# EasyEDA Pro project 数控电源_V3.eprj, board 电源板pcb
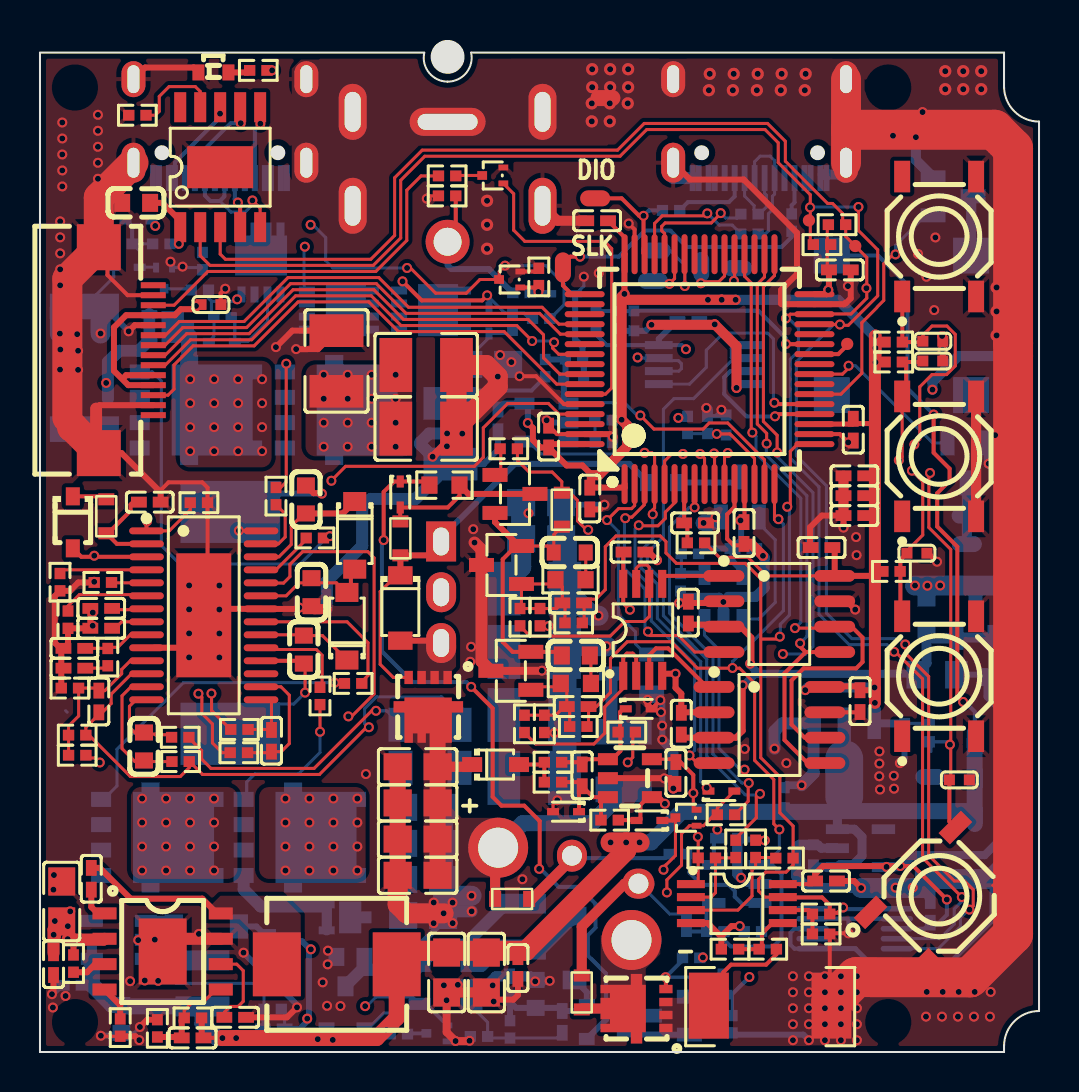
[diagram p9: board, top side]
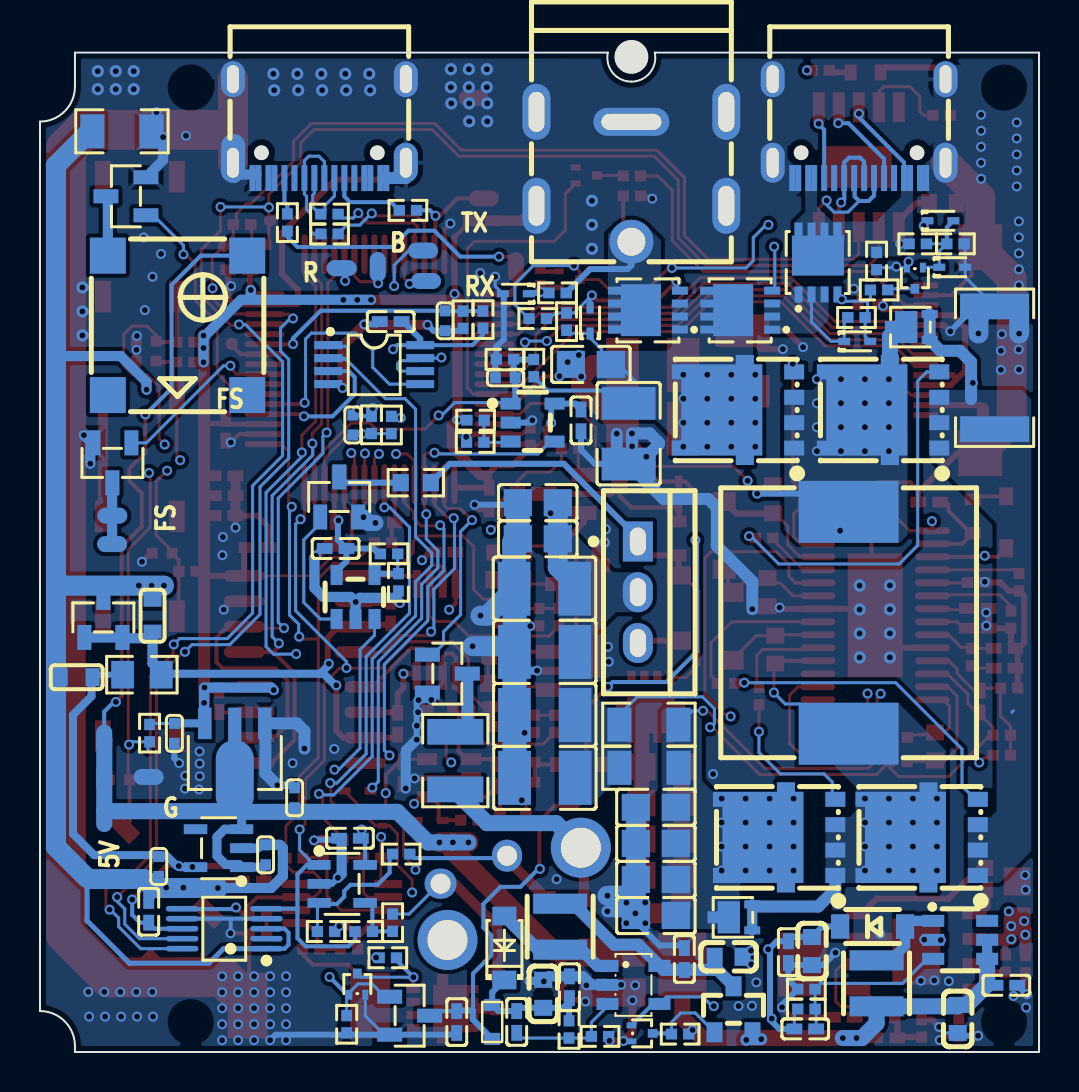
[diagram p10: board, bottom side, seen from below]

Outline 50 x 50.63 mm; copper layers: Top Layer, Inner1, Inner2, Bottom Layer. Coordinates in mm from the lower left corner of the outline.
Outline path: 0,50 19.23,50 arc(19.47,48.99) 20.41,48.55 arc(21.34,48.99) 21.58,50 48.25,50 48.25,48.3 arc(48.76,47.06) 50,46.55 50,2.05 arc(48.76,1.54) 48.25,0.3 48.25,0 0,0 0,50
Stack: Top Layer 0.035mm 外层铜厚1oz / Dielectric1 0.2104mm 7628 RC49% 8.6mil / Inner1 0.0152mm 内层铜厚 / Dielectric2 1.065mm 1.1mm H/HOZ Copper / Inner2 0.0152mm 内层铜厚 / Dielectric3 0.2104mm 7628 RC49% 8.6mil / Bottom Layer 0.035mm 外层铜厚1oz

## Design rules (mm)
net USBDP: USB
net UDBDM: USB
spacing copperThickness1oz (default): track to track 0.152, other pairs 0.152 to 0.3
spacing Plane_innerPlane: track to track 0.152, other pairs 0.152 to 0.3
spacing Copper_copperRegion: track to track 0.152, other pairs 0.152 to 0.3
spacing Copper_DING_GND: track to track 0.152, other pairs 0.152 to 0.3
track width copperThickness1oz (default): min 0.127, default 0.254, max 10
track width copperThickness2oz: min 0.203, default 0.254, max 2.54
differential pair differentialPair (default): width min 0.127, default 0.152, max 2.54; gap min 0.203, default 0.203
net DGND uses DING_GND
pour e2830 uses copperRegion
pour e3047 uses copperRegion
pour e3212 uses DING_GND
pour e3215 uses DING_GND

## Placement (name value [footprint] x y rotation side)
BUZZER1  2.7kHz  [BUZ-SMD_4P-L8.5-W8.5_FUET-8530-05]  43.11 36.36 90 bottom
C1  100nF  [C0402]  2.57 8.67 90 top
C2  10uF  [电容0402]  38.71 9.87 90 bottom
C3  10uF  [电容0402]  44.06 9.29 270 bottom
C4  100nF  [C0402]  0.68 4.4 270 top
C5  22uF  [C0805]  22.34 3.98 90 top
C6  22uF  [C0805]  20.35 3.98 90 top
C7  100nF  [C0402]  23.92 4.2 90 top
C8  10nF  [C0402]  9.77 1.74 180 top
C9  10pF  [C0402]  7.64 0.71 0 top
C11  10uF  [C0402]  40.76 26.84 0 top
C12  10uF  [C0402]  40.76 27.83 0 top
C13  10uF  [C0402]  25.46 30.79 270 top
C14  10uF  [电容0603]  48.16 18.75 180 bottom
C15  10uF  [电容0603]  44.37 21.83 270 bottom
C16  1uF  [C0603]  4.81 42.48 0 top
C17  10uF  [电容0402]  37.25 12.72 90 bottom
C18  10uF  [电容0402]  43.27 15.94 270 bottom
C19  100nF  [C0402]  40.03 39.13 0 top
C20  100nF  [C0402]  27.88 41.59 180 top
C21  100nF  [C0402]  27.52 27.69 270 top
C22  100nF  [C0402]  40.7 31.14 270 top
C23  100nF  [C0402]  32.78 26.47 0 top
C24  100nF  [电容0402]  46.01 13.62 180 top
C25  100nF  [电容0402]  43.89 24.96 180 top
C26  100nF  [C0402]  35.24 25.97 270 top
C27  100nF  [电容0402]  44.68 34.57 180 top
C28  100nF  [电容0402]  44.68 35.56 180 top
C29  100nF  [电容0402]  8.56 37.39 0 top
C30  100nF  [C0402]  39.11 25.24 180 top
C31  100nF  [C0402]  32.1 16.43 90 top
C32  100nF  [C0402]  41.04 17.56 270 top
C33  1uF  [C0603]  5.21 15.29 270 top
C34  100uF  [C1210]  24.75 23.18 180 bottom
C35  100uF  [C1210]  24.74 16.86 180 bottom
C36  100uF  [C1210]  24.74 20.02 180 bottom
C37  100uF  [C1210]  24.73 13.72 180 bottom
C38  100nF  [C0805]  25.08 25.68 180 bottom
C39  100nF  [C0805]  25.09 27.48 180 bottom
C40  10pF  [C0402]  2.95 17.54 270 top
C41  100nF  [C0402]  5.5 27.51 0 top
C42  1uF  [C0603]  13.31 27.64 270 top
C43  1uF  [C0603]  13.2 20.13 90 top
C44  220pF  [C0402]  3.07 22.19 0 top
C49  560pF  [C0402]  1.72 20.2 0 top
C50  100nF  [C0402]  3.07 21.2 0 top
C51  33nF  [C0402]  1.72 19.2 0 top
C52  100uF  [C1210]  14.84 34.57 270 top
C53  100uF  [C1210]  20.54 30.93 90 bottom
C54  100uF  [C1210]  19.33 34.37 180 top
C55  100uF  [C1210]  19.33 31.19 180 top
C56  100nF  [C0805]  22.43 34.4 180 bottom
C58  1uF  [C0603]  13.59 23.01 90 top
C59  47pF  [C0402]  11.59 15.57 270 top
C60  68nF  [C0603]  26.82 19.84 180 top
C61  10pF  [C0402]  26.91 17.28 0 top
C62  68nF  [C0603#2]  26.51 24.99 0 top
C63  10pF  [C0402]  26.69 22.47 180 top
C64  10uF  [C0805]  18.9 12.46 0 top
C65  10uF  [C0805]  18.9 14.27 0 top
C66  100nF  [C0805]  18.9 10.65 0 top
C67  100nF  [C0805]  18.9 8.84 0 top
C68  100nF  [C0402]  32.45 36.54 0 bottom
C69  100nF  [C0402]  35.2 25.19 0 bottom
C70  100nF  [C0402]  34.49 10.69 0 bottom
C71  100nF  [C0402]  27.14 13.84 270 top
C72  10pF  [C0402]  26.14 1.51 90 bottom
C73  100nF  [C0402]  32.45 21.98 90 top
C74  100nF  [C0402]  29.75 25.01 0 top
C76  100nF  [C0402]  17.75 4.65 270 bottom
C78  100nF  [C0402]  23.5 3.24 270 bottom
C79  100nF  [C0402]  31.83 13.96 270 top
C80  100nF  [C0402]  44.56 7.02 90 bottom
C81  10pF  [C0402]  11.7 1.16 0 bottom
C82  10uF  [C0603]  11.36 5.05 90 bottom
C83  100nF  [C0402]  12.54 5 90 bottom
C84  100nF  [C0402]  39.34 8.56 0 top
C85  100nF  [电容0402]  26.71 33.73 180 bottom
C86  100nF  [电容0402]  34.34 31.37 270 bottom
C87  100nF  [C0402]  22.92 31.6 270 bottom
C88  100nF  [电容0402]  29.73 36.58 90 bottom
C91  1uF  [C0603]  15.54 4.76 0 bottom
C92  1uF  [C0603]  24.81 2.91 270 bottom
C93  100nF  [C0402]  29.14 1.5 90 bottom
C98  100nF  [C0402]  1.63 3.34 0 bottom
C99  10uF  [C0805]  19.18 6.83 180 bottom
C100  10uF  [C0805]  19.18 8.63 180 bottom
C101  10uF  [C0805]  19.18 10.44 180 bottom
C102  10uF  [C0805]  19.18 12.24 180 bottom
C103  10uF  [C0805]  1.09 7.53 270 top
C105  10uF  [C0603]  4.07 1.65 90 bottom
C106  10uF  [C0402]  40.76 28.83 0 top
D1  TPZ13VC-523  [SOD-523_L1.2-W0.8-LS1.6-RD]  9.1 35.56 180 bottom
D2  1N5819WS S4  [SOD-323_L1.6-W1.3-LS2.7-RD]  1.64 26.5 270 top
D3  DSS110  [SOD-123_L2.8-W1.8-LS3.7-RD]  15.75 25.85 270 top
D4  DSS110  [SOD-123_L2.8-W1.8-LS3.7-RD]  15.36 21.3 90 top
D6  BZT52C12  [SOD-123_L2.7-W1.6-LS3.7-RD]  18.03 22.21 270 top
D7  MM5Z3V3  [SOD-523_L1.2-W0.8-LS1.6-RD]  29.96 17.17 0 top
D8  TPSDM20U40  [SOD-523_L1.2-W0.8-LS1.6-RD]  34.1 13.06 0 top
D9  TPZ13VC-523  [SOD-523_L1.2-W0.8-LS1.6-RD]  22.47 36.6 90 bottom
D11  MM5Z3V3  [SOD-523_L1.2-W0.8-LS1.6-RD]  26.33 12.02 180 top
D12  1N5819W  [SOD-123_L2.7-W1.6-LS3.7-R-RD]  8.33 6.28 180 bottom
D13  1N5819WS  [SOD-323_L1.8-W1.3-LS2.5-RD]  22.8 14.38 0 top
D15  TPZ13VC-523  [SOD-523_L1.2-W0.8-LS1.6-RD]  26.18 37.94 0 bottom
D20  PMEG6020EPA,115  [SOT-1061_L2.0-W2.0-P1.30-BR]  6.23 36.27 180 bottom
D21  PMEG6020EPA,115  [SOT-1061_L2.0-W2.0-P1.30-BR]  15.11 6.74 180 bottom
D23  TPZ13VC-523  [SOD-523_L1.2-W0.8-LS1.6-RD]  4.34 39.26 180 bottom
D24  TPSDM20U40  [SOD-523_L1.2-W0.8-LS1.6-RD]  30.5 11.58 180 top
D25  TPSDM20U40  [SOD-523_L1.2-W0.8-LS1.6-RD]  18.03 27.89 270 top
H1  -  [DC-2-DIP]  22.93 10.22 270 top
H2  1mm通孔  [DC-1-DIP]  26.62 9.83 180 top
H3  -  [DC-2-DIP]  29.6 5.61 180 bottom
H4  1mm通孔  [DC-1-DIP]  29.95 8.42 270 top
L1  4.7uH  [IND-SMD_L7.0-W6.6]  14.85 4.39 0 top
L2  2.2uH  [IND-SMD_L13.5-W12.8_TMPC1265HP]  9.53 21.47 270 bottom
L3  4.7uH  [IND-SMD_L3.0-W3.0-1]  23.97 6.27 270 bottom
L4  4.7uH  [IND-SMD_L3.0-W3.0-1]  8.13 3.44 90 bottom
LED1  侧帖 绿  [LED-SMD_L1.7-W1.1-R-RD_GREEN]  8.68 49.01 0 top
NOREF  -  [Pad_e446]  38.49 41.6 0 top
NOREF#2  -  [Pad_e448]  40.4 35.43 0 top
NOREF#3  -  [Pad_e447]  40.8 40.32 0 top
Q1  DOZ40P04  [PDFN-8_L3.1-W3.1-P0.65-LS3.4-BL]  14.96 37.12 90 bottom
Q2  DOZ40P04  [PDFN-8_L3.1-W3.1-P0.65-LS3.4-BL]  11.06 39.5 180 bottom
Q3  DOZ40P04  [PDFN-8_L3.1-W3.1-P0.65-LS3.4-BL]  19.57 37.12 90 bottom
Q4  40N06D  [WDFN-5_L3.3-W3.3-P0.65-BL]  19.43 18 180 top
Q5  2N7002  [SOT-23-3_L2.9-W1.3-P1.90-LS2.4-BR]  35.02 27.77 270 bottom
Q6  BSS138NH6327-ES  [SOT-23-3_L2.9-W1.3-P1.90-LS2.4-BR]  23.77 27.92 180 top
Q7  AP2310  [SOT-23-3_L2.9-W1.3-P1.90-LS2.4-BR]  29.61 18.93 0 bottom
Q8  40N06D  [WDFN-5_L3.3-W3.3-P0.65-BL]  30.59 2.18 90 top
Q10  2N7002  [SOT-23-3_L2.9-W1.3-P1.90-LS2.4-BR]  31.5 1.82 0 bottom
Q13  AO3400A  [SOT-23-3_L2.9-W1.3-P1.90-LS2.4-BR]  46.37 29.47 90 bottom
Q14  2N7002KM  [SOT-723-3_L1.2-W0.8-P0.80-LS1.2-BR]  6.21 38.71 90 bottom
Q15  2N7002KM  [SOT-723-3_L1.2-W0.8-P0.80-LS1.2-BR]  23.51 38.65 0 top
Q16  2N7002-HXY  [SOT-23-3_L2.9-W1.3-P1.90-LS2.4-BR]  45.7 42.81 180 bottom
Q17  2N7002KM  [SOT-723-3_L1.2-W0.8-P0.80-LS1.2-BR]  22.66 43.85 0 top
Q18  AO3401A  [SOT-23_L2.9-W1.3-P1.90-LS2.4-BR]  15.29 2.14 270 bottom
Q19  2N7002KM  [SOT-723-3_L1.2-W0.8-P0.80-LS1.2-BR]  19.87 0.93 0 bottom
Q20  KM3139K  [SOT-723-3_L1.2-W0.8-P0.80-LS1.2-BR]  32.33 11.72 0 top
Q21  2N7002KM  [SOT-723-3_L1.2-W0.8-P0.80-LS1.2-BR]  34.12 3.4 270 bottom
R1  20kΩ  [R0402]  8.13 39.57 90 bottom
R2  180kΩ  [R0402]  1.68 4.42 90 top
R3  30kΩ  [R0402]  9.14 36.75 0 bottom
R4  10kΩ  [R0402]  6.07 40.43 0 bottom
R5  30kΩ  [R0402]  20.38 42.83 0 top
R6  100kΩ  [R0402]  7.65 1.71 0 top
R7  200kΩ  [R0402]  4.02 1.22 90 top
R8  30kΩ  [R0402]  23.65 36.54 270 bottom
R9  20kΩ  [R0402]  5.88 1.18 270 top
R10  10kΩ  [R0402]  8 38.13 180 bottom
R11  10kΩ  [R0402]  25.09 36.69 180 bottom
R12  10kΩ  [R0402]  24.1 37.98 180 bottom
R13  30Ω  [R0805_NEW]  44.9 18.88 180 bottom
R15  30kΩ  [R0402]  4.18 40.43 0 bottom
R16  30kΩ  [R0402]  24.96 38.78 270 top
R18  210kΩ  [R0402]  4.88 46.87 180 top
R19  0Ω  [R1206]  45.9 46.06 0 bottom
R20  680Ω  [R0402]  10.93 49.11 180 top
R21  10kΩ  [R0402]  32.83 25.47 180 top
R22  10kΩ  [R0402]  44.52 15.95 270 bottom
R23  100Ω  [R0402]  7.04 14.53 0 top
R24  100Ω  [R0402]  7.02 15.75 0 top
R25  10kΩ  [R0402]  7.95 27.48 0 top
R26  10Ω  [R0603#2]  3.32 26.8 90 top
R27  200kΩ  [R0402]  1 23.51 90 top
R28  0Ω  [R0402]  14.01 17.81 90 top
R29  300kΩ  [R0402]  1.86 15.85 0 top
R30  0Ω  [R0402]  11.81 27.81 90 top
R31  0Ω  [R0402]  3.15 23.49 0 top
R32  20kΩ  [R0402]  1.4 21.63 90 top
R33  30kΩ  [R0402]  1.86 14.85 0 top
R34  10kΩ  [R0402]  1.5 18.21 0 top
R35  10kΩ  [R0402]  3.39 19.76 90 top
R36  0Ω  [R0402]  13.76 25.72 0 top
R37  0Ω  [R0402]  15.67 18.44 0 top
R38  100Ω  [R0402]  9.95 14.97 180 top
R39  3mΩ  [R2512]  2.22 34.23 270 bottom
R40  100Ω  [R0402]  9.98 16.14 180 top
R41  470Ω  [R0603]  26.82 18.44 0 top
R42  1kΩ  [R0402]  32.53 24.92 180 bottom
R43  10kΩ  [R0402]  42.62 24.05 0 top
R44  1kΩ  [R0402]  32.06 23.5 90 bottom
R45  150Ω  [R0603]  26.55 23.63 180 top
R46  10kΩ  [R0603]  20.24 28.36 180 top
R47  330Ω  [R0603#2]  26.12 27.13 90 top
R48  15kΩ  [R0402]  26.94 16.28 0 top
R49  10kΩ  [R0402]  42.73 34.52 0 top
R50  2kΩ  [R0603#2]  18.04 25.7 270 top
R51  100kΩ  [R0402]  33.37 9.71 0 top
R52  750Ω  [R1210]  29.21 14.58 270 bottom
R53  12kΩ  [R0402]  24.25 16.42 270 top
R54  12kΩ  [R0402]  24.02 21.75 270 top
R55  4.3kΩ  [R0402]  23.46 30.18 0 top
R56  68kΩ  [R0402]  25.24 16.42 270 top
R57  68kΩ  [R0402]  25.02 21.75 270 top
R58  10kΩ  [R0402]  34.82 10.16 90 top
R59  10kΩ  [R0402]  37.26 9.7 180 top
R60  100kΩ  [R0402]  35.81 10.16 90 top
R61  10kΩ  [R0402]  42.73 35.52 0 top
R62  510Ω  [R0603#2]  27.37 1.51 90 bottom
R63  10kΩ  [R0402]  32.59 4.71 0 bottom
R64  47kΩ  [R0402]  29.37 16.01 0 top
R65  2kΩ  [R0402]  39.89 41.39 180 top
R66  2kΩ  [R0402]  39.14 40.39 0 top
R67  0Ω  [R0402]  37.62 41.5 90 bottom
R68  20kΩ  [R0402]  25.68 14.5 180 top
R69  0Ω  [R0402]  31.59 42.11 180 bottom
R70  2kΩ  [R0402]  34.33 11.87 180 top
R71  2kΩ  [R0402]  25.68 13.5 180 top
R72  20kΩ  [R0402]  17.96 0.9 0 bottom
R73  51kΩ  [R0402]  23.52 1.13 90 bottom
R75  56kΩ  [R0402]  28.51 11.6 180 top
R76  1.8kΩ  [R0402]  21.97 0.78 0 bottom
R77  40mΩ  [RES-SMD_L6.4-W3.2-R2512]  36.55 2.32 180 top
R78  10kΩ  [R0402]  34.65 1.39 270 bottom
R79  10kΩ  [R0402]  32.35 6.47 270 bottom
R80  1kΩ  [R0402]  33.8 6.03 0 bottom
R81  1.2kΩ  [R0402]  39.09 5.91 180 top
R82  15kΩ  [R0402]  39.09 6.91 0 top
R84  13kΩ  [R0402]  11.64 2.15 0 bottom
R85  12kΩ  [R0402]  25.29 34.21 270 bottom
R86  12kΩ  [R0402]  32.41 31.37 90 bottom
R87  1.2kΩ  [R0402]  36.42 5.15 180 top
R88  100Ω  [R0603#2]  23.63 7.66 0 top
R89  1kΩ  [R0402]  11.64 3.15 180 bottom
R90  15kΩ  [R0402]  34.53 5.15 180 top
R92  1kΩ  [R0402]  26.73 34.66 180 bottom
R93  1kΩ  [R0402]  33.41 31.38 270 bottom
R94  10kΩ  [R0402]  31.92 9.9 0 bottom
R95  1kΩ  [R0402]  35.68 6.03 180 bottom
R96  100Ω  [R0603#2]  27.11 2.98 90 top
R97  NCP15XH103F03RC  [R0402]  27.83 36.64 270 bottom
R98  20kΩ  [R0402]  28.2 31.61 0 bottom
R99  1kΩ  [R0402]  28.83 36.63 90 bottom
R100  2.4kΩ  [R0402]  28.22 30.5 180 bottom
R101  15kΩ  [R0402]  26.71 21.47 180 top
R102  22Ω  [R0402]  35.51 41.92 180 bottom
R103  22Ω  [R0402]  35.51 40.93 180 bottom
R104  510Ω  [R0603]  31.19 28.48 180 bottom
R105  10Ω  [R0402]  20.38 43.83 180 top
SW1  BTS0C0052MMG00  [SW-SMD_4P-L5.2-W5.2-P3.70-LS6.4]  45 7.8 45 top
SW2  BTS0C0052MMG00  [SW-SMD_4P-L5.2-W5.2-P3.70-LS6.4]  45 18.8 90 top
SW3  BTS0C0052MMG00  [SW-SMD_4P-L5.2-W5.2-P3.70-LS6.4]  45 29.8 90 top
SW4  BTS0C0052MMG00  [SW-SMD_4P-L5.2-W5.2-P3.70-LS6.4]  45 40.8 90 top
U1  H7211-33M5R  [SOT-23-5_L3.0-W1.7-P0.95-LS2.8-BL]  41.06 10.2 90 bottom
U2  SCT2432STER  [ESOP-8_L4.9-W3.9-P1.27-LS6.0-BL-EP]  6.14 5.03 270 top
U3  DC007B-2.5-J  [DC-IN-TH_HX-DC007B-2.5]  20.4 43.79 270 bottom
U4  TPSDM20U40  [SOD-523_L1.2-W0.8-LS1.6-RD]  4.94 41.59 180 bottom
U5  TL431  [SOT-23-3_L2.9-W1.3-P1.90-LS2.4-BR]  46.83 21.74 270 bottom
U7  CH224A  [ESSOP-10_L4.9-W3.9-P1.0-LS6.0-TL-EP]  9.02 44.27 0 top
U8  AT32F403ARCT7  [LQFP-64_L10.0-W10.0-P0.50-LS12.0-BL]  33.01 34.16 0 top
U9  -  [SMT_0.8*1.5]  26.17 39.25 0 top
U10  -  [SMT_0.8*1.5]  27.79 42.71 270 top
U11  AFD01-S14FCA-00  [FPC-SMD_14P-P0.50_JS_AFD01-S14FCA-00]  4.31 35.11 90 top
U12  DAC8830ICDR  [SOIC-8_L4.9-W3.9-P1.27-LS6.0-BL]  37 21.92 270 top
U13  DAC8830ICDR  [SOIC-8_L4.9-W3.9-P1.27-LS6.0-BL]  36.51 16.36 270 top
U14  RS8552XM  [MSOP-8_L3.0-W3.0-P0.65-LS4.9-BL]  30.17 21.12 0 top
U16  12mΩ  [R1206]  19.52 16.38 0 bottom
U17  LM5176PWPR  [HTSSOP-28_L9.8-W4.5-P0.65-LS6.6-BL-EP]  8.2 21.85 270 top
U18  12mΩ  [R1206]  19.52 14.22 0 bottom
U19  80N06F  [DFN-5_L4.9-W5.9-P1.27-LS6.2-BL]  14.07 32.12 90 bottom
U20  80N06F  [DFN-5_L4.9-W5.9-P1.27-LS6.2-BL]  12.01 10.74 90 bottom
U21  80N06F  [DFN-5_L4.9-W5.9-P1.27-LS6.2-BL]  6.81 32.12 90 bottom
U22  80N06F  [DFN-5_L4.9-W5.9-P1.27-LS6.2-BL]  4.87 10.74 90 bottom
U23  GS8743-TR  [SOT-23-5_L2.9-W1.6-P0.95-LS2.8-BL]  34.21 22.76 180 bottom
U24  MPG90N08P  [TO-220-3_L10.2-W4.6-P2.54-L]  20.08 23 270 bottom
U25  BL432 1%  [SOT-23-3_L2.9-W1.3-P0.95-LS2.4-BR]  23.57 19.07 0 top
U26  BL432 1%  [SOT-23-3_L2.9-W1.3-P0.95-LS2.4-BR]  23.1 24.37 0 top
U27  RS8551XF  [SOT-23-5_L3.0-W1.7-P0.95-LS2.8-BL]  34.88 8.41 270 bottom
U29  K26  [SOD-123FL_L2.8-W1.8-LS3.8-RD]  26.76 5.2 90 bottom
U30  ADS1115IDGSR  [MSOP-10_L3.0-W3.0-P0.50-LS5.0-BL]  40.78 6.17 90 bottom
U31  RS321BXF  [SOT-23-5_L2.9-W1.6-P0.95-LS2.8-BL]  29.52 13.7 270 top
U32  SGM6601YTN5G/TR  [SOT-23-5_L3.0-W1.7-P0.95-LS2.8-BR]  20.3 3.36 0 bottom
U33  LN3608AR-G  [SOT-23-6_L2.9-W1.6-P0.95-LS2.8-BR]  3.95 5.61 0 bottom
U34  -  [SMT_0.8*1.5]  46.79 11.76 180 bottom
U35  -  [SMT_0.8*1.5]  46.79 15.63 0 bottom
U36  -  [SMT_0.8*1.5]  46.38 26.84 90 bottom
U37  -  [SMT_0.8*1.5]  30.83 40.1 270 bottom
U38  -  [SMT_0.8*1.5]  46.39 25.41 270 bottom
U39  GSV331-TR  [SOT-23-5_L2.9-W1.6-P0.95-LS2.8-BR]  25.35 31.49 0 bottom
U40  -  [SMT_0.8*1.5]  30.68 38.57 90 bottom
U41  -  [SMT_0.8*1.5]  46.79 13.69 0 bottom
U42  -  [SMT_0.8*1.5]  34.9 39.21 270 bottom
U43  -  [SMT_0.8*1.5]  28.3 47.73 90 top
U44  -  [SMT_0.8*1.5]  33.1 39.27 180 bottom
U45  -  [SMT_0.8*1.5]  44.56 13.76 270 bottom
U47  RS8552XM  [MSOP-8_L3.0-W3.0-P0.65-LS4.9-BL]  33.27 34.39 270 bottom
U48  RS8552XM  [MSOP-8_L3.0-W3.0-P0.65-LS4.9-BL]  34.88 7.43 270 top
U49  MG6228N3B-33  [SOT-89-3_L4.5-W2.5-P1.50-LS4.2-BR]  40.25 15.09 90 bottom
USBC1  TYPE-C-31-M-12  [USB-C_SMD-TYPE-C-31-M-12]  9.01 46.2 0 bottom
USBC2  TYPE-C-31-M-12  [USB-C_SMD-TYPE-C-31-M-12]  36.02 46.2 0 bottom

## Footprints (pads in the part's own frame, mm; a bottom-side part is the same pattern mirrored in y, then rotated)
BUZ-SMD_4P-L8.5-W8.5_FUET-8530-05
  rect 1.8x1.8 smd: 1(3.488,-3.488) 2(3.488,3.488) 3(-3.488,3.488) 4(-3.488,-3.488)
C0402
  rect 0.79x0.54 smd: 1(-0.545,0) 2(0.545,0)
C0603
  rect 0.8x0.9 smd: 1(-0.7,0) 2(0.7,0)
C0603#2
  rect 0.7x0.8 smd: 1(-0.8,0) 2(0.8,0)
C0805
  rect 1.41x1.35 smd: 1(-1,0) 2(1,0)
C1210
  rect 1.635x2.7 smd: 1(-1.518,0) 2(1.518,0)
DC-1-DIP
  oval 1.5x1.6 hole 1: 1(-0.004,0.004)
DC-2-DIP
  round 3 hole 2: 1(0,0)
DC-IN-TH_HX-DC007B-2.5
  round 2.2 hole 1.4: 1(3.25,0)
  oval 1.4x3.8 hole 0.8x3: 2(-2.75,0)
  oval 2.8x1.4 hole 2x0.8: 3(-3.25,-4.75) 3(-3.25,4.75) 3(1.45,-4.75) 3(1.45,4.75)
DFN-5_L4.9-W5.9-P1.27-LS6.2-BL
  rect 0.75x1 smd: 1(-1.905,-1.811) 2(-0.635,-1.811) 3(0.635,-1.811) 4(1.905,-1.811)
  custom 5.51x4.53 smd: 5(0,1.811)
ESOP-8_L4.9-W3.9-P1.27-LS6.0-BL-EP
  rect 0.6x1.2 smd: 1(-1.905,-2.909) 2(-0.635,-2.909) 3(0.635,-2.909) 4(1.905,-2.909) 5(1.905,2.909) 6(0.635,2.909) 7(-0.635,2.909) 8(-1.905,2.909)
  rect 3.3x2.4 smd: 9(0,0)
ESSOP-10_L4.9-W3.9-P1.0-LS6.0-TL-EP
  rect 0.6x1.5 smd: 1(-2,-3) 2(-1,-3) 3(0,-3) 4(1,-3) 5(2,-3) 6(2,3) 7(1,3) 8(0,3) 9(-1,3) 10(-2,3)
  rect 3.3x2.1 smd: 11(0,0)
FPC-SMD_14P-P0.50_JS_AFD01-S14FCA-00
  rect 0.3x1.25 smd: 1(-3.25,-1.363) 2(-2.75,-1.363) 3(-2.25,-1.363) 4(-1.75,-1.363) 5(-1.25,-1.363) 6(-0.75,-1.363) 7(-0.25,-1.363) 8(0.25,-1.363) 9(0.75,-1.363) 10(1.25,-1.363) 11(1.75,-1.363) 12(2.25,-1.363) 13(2.75,-1.363) 14(3.25,-1.363)
  rect 2.3x2.2 smd: 15(5.15,1.363) 16(-5.15,1.363)
HTSSOP-28_L9.8-W4.5-P0.65-LS6.6-BL-EP
  oval 0.343x1.732 smd: 1(-4.225,-2.866) 2(-3.575,-2.866) 3(-2.925,-2.866) 4(-2.275,-2.866) 5(-1.625,-2.866) 6(-0.975,-2.866) 7(-0.325,-2.866) 8(0.325,-2.866) 9(0.975,-2.866) 10(1.625,-2.866) 11(2.275,-2.866) 12(2.925,-2.866) 13(3.575,-2.866) 14(4.225,-2.866) 15(4.225,2.866) 16(3.575,2.866) 17(2.925,2.866) 18(2.275,2.866) 19(1.625,2.866) 20(0.975,2.866) 21(0.325,2.866) 22(-0.325,2.866) 23(-0.975,2.866) 24(-1.625,2.866) 25(-2.275,2.866) 26(-2.925,2.866) 27(-3.575,2.866) 28(-4.225,2.866)
  rect 6.2x2.75 smd: 29(0,0)
IND-SMD_L3.0-W3.0-1
  rect 1x2.7 smd: 1(-1.15,0) 2(1.15,0)
IND-SMD_L7.0-W6.6
  rect 2.4x3.2 smd: 1(-3,0) 2(3,0)
IND-SMD_L13.5-W12.8_TMPC1265HP
  rect 3.1x5 smd: 1(-5.55,0) 2(5.55,0)
LED-SMD_L1.7-W1.1-R-RD_GREEN
  rect 0.6x0.8 smd: 1(0.75,0) 2(-0.75,0)
LQFP-64_L10.0-W10.0-P0.50-LS12.0-BL
  oval 0.3x2 smd: 1(-3.75,-5.75) 2(-3.25,-5.75) 3(-2.75,-5.75) 4(-2.25,-5.75) 5(-1.75,-5.75) 6(-1.25,-5.75) 7(-0.75,-5.75) 8(-0.25,-5.75) 9(0.25,-5.75) 10(0.75,-5.75) 11(1.25,-5.75) 12(1.75,-5.75) 13(2.25,-5.75) 14(2.75,-5.75) 15(3.25,-5.75) 16(3.75,-5.75) 33(3.75,5.75) 34(3.25,5.75) 35(2.75,5.75) 36(2.25,5.75) 37(1.75,5.75) 38(1.25,5.75) 39(0.75,5.75) 40(0.25,5.75) 41(-0.25,5.75) 42(-0.75,5.75) 43(-1.25,5.75) 44(-1.75,5.75) 45(-2.25,5.75) 46(-2.75,5.75) 47(-3.25,5.75) 48(-3.75,5.75)
  oval 2x0.3 smd: 17(5.75,-3.75) 18(5.75,-3.25) 19(5.75,-2.75) 20(5.75,-2.25) 21(5.75,-1.75) 22(5.75,-1.25) 23(5.75,-0.75) 24(5.75,-0.25) 25(5.75,0.25) 26(5.75,0.75) 27(5.75,1.25) 28(5.75,1.75) 29(5.75,2.25) 30(5.75,2.75) 31(5.75,3.25) 32(5.75,3.75) 49(-5.75,3.75) 50(-5.75,3.25) 51(-5.75,2.75) 52(-5.75,2.25) 53(-5.75,1.75) 54(-5.75,1.25) 55(-5.75,0.75) 56(-5.75,0.25) 57(-5.75,-0.25) 58(-5.75,-0.75) 59(-5.75,-1.25) 60(-5.75,-1.75) 61(-5.75,-2.25) 62(-5.75,-2.75) 63(-5.75,-3.25) 64(-5.75,-3.75)
MSOP-8_L3.0-W3.0-P0.65-LS4.9-BL
  rect 0.406x1.397 smd: 1(-0.975,-2.3) 2(-0.325,-2.3) 3(0.325,-2.3) 4(0.975,-2.3) 5(0.975,2.3) 6(0.325,2.3) 7(-0.325,2.3) 8(-0.975,2.3)
MSOP-10_L3.0-W3.0-P0.50-LS5.0-BL
  oval 0.28x1.62 smd: 1(-1,-2.11) 2(-0.5,-2.11) 3(0,-2.11) 4(0.5,-2.11) 5(1,-2.11) 6(1,2.11) 7(0.5,2.11) 8(0,2.11) 9(-0.5,2.11) 10(-1,2.11)
Pad_e446
  round 0.61 smd: TP1(0,0)
Pad_e447
  round 0.61 smd: TP2(0,0)
Pad_e448
  round 0.61 smd: TP1(0,0)
PDFN-8_L3.1-W3.1-P0.65-LS3.4-BL
  rect 0.4x0.8 smd: 1(-0.975,-1.6) 2(-0.325,-1.6) 3(0.325,-1.6) 4(0.975,-1.6) 5(0.975,1.6) 6(0.325,1.6) 7(-0.325,1.6) 8(-0.975,1.6)
  rect 2.6x2 smd: 9(-0.004,0.35)
R0402
  rect 0.566x0.54 smd: 1(-0.433,0) 2(0.433,0)
R0603
  rect 0.806x0.864 smd: 1(-0.753,0) 2(0.753,0)
R0603#2
  rect 0.6x0.8 smd: 1(-0.85,0) 2(0.85,0)
R0805_NEW
  rect 1.133x1.377 smd: 1(-0.966,0) 2(0.966,0)
R1206
  rect 1.208x1.701 smd: 1(-1.479,0) 2(1.479,0)
R1210
  rect 1.282x2.808 smd: 1(-1.441,0) 2(1.441,0)
R2512
  rect 1.282x3.456 smd: 1(-3.067,0) 2(3.067,0)
RES-SMD_L6.4-W3.2-R2512
  rect 2x3.3 smd: 1(-3.067,0) 2(3.067,0)
SMT_0.8*1.5
  oval 0.8x1.5 smd: 1(0,0)
SOD-123_L2.7-W1.6-LS3.7-R-RD
  rect 0.909x1.219 smd: 1(1.625,0) 2(-1.625,0)
SOD-123_L2.7-W1.6-LS3.7-RD
  rect 0.91x1.22 smd: 1(-1.635,0) 2(1.635,0)
SOD-123_L2.8-W1.8-LS3.7-RD
  rect 0.95x1.15 smd: 1(-1.692,0) 2(1.692,0)
SOD-123FL_L2.8-W1.8-LS3.8-RD
  rect 0.93x1.2 smd: 1(-1.6,0) 2(1.6,0)
SOD-323_L1.6-W1.3-LS2.7-RD
  rect 0.9x0.7 smd: 1(-1.3,0) 2(1.3,0)
SOD-323_L1.8-W1.3-LS2.5-RD
  rect 1x0.75 smd: 1(-1.173,0) 2(1.173,0)
SOD-523_L1.2-W0.8-LS1.6-RD
  rect 0.6x0.36 smd: 1(-0.65,0) 2(0.65,0)
SOIC-8_L4.9-W3.9-P1.27-LS6.0-BL
  oval 0.588x2.045 smd: 1(-1.905,-2.772) 2(-0.635,-2.772) 3(0.635,-2.772) 4(1.905,-2.772) 5(1.905,2.772) 6(0.635,2.772) 7(-0.635,2.772) 8(-1.905,2.772)
SOT-23-3_L2.9-W1.3-P0.95-LS2.4-BR
  rect 1.25x0.7 smd: 1(1,-0.95) 2(1,0.95) 3(-1,0)
SOT-23-3_L2.9-W1.3-P1.90-LS2.4-BR
  rect 1.25x0.7 smd: 1(1,-0.95) 2(1,0.95) 3(-1,0)
SOT-23-5_L2.9-W1.6-P0.95-LS2.8-BL
  rect 0.6x1 smd: 1(-0.95,-1.1) 2(0,-1.1) 3(0.95,-1.1) 4(0.95,1.1) 5(-0.95,1.1)
SOT-23-5_L2.9-W1.6-P0.95-LS2.8-BR
  rect 1x0.6 smd: 1(1.1,-0.95) 2(1.1,0) 3(1.1,0.95) 4(-1.1,0.95) 5(-1.1,-0.95)
SOT-23-5_L3.0-W1.7-P0.95-LS2.8-BL
  rect 0.49x1.157 smd: 1(-0.95,-1.153) 2(0,-1.153) 3(0.95,-1.153)
  rect 0.49x1.175 smd: 4(0.95,1.153) 5(-0.95,1.153)
SOT-23-5_L3.0-W1.7-P0.95-LS2.8-BR
  rect 1.1x0.6 smd: 1(1.3,-0.95) 2(1.3,0) 3(1.3,0.95) 4(-1.3,0.95) 5(-1.3,-0.95)
SOT-23-6_L2.9-W1.6-P0.95-LS2.8-BR
  rect 1.1x0.6 smd: 1(1.35,-0.95) 2(1.35,0) 3(1.35,0.95) 4(-1.35,0.95) 5(-1.35,0) 6(-1.35,-0.95)
SOT-23_L2.9-W1.3-P1.90-LS2.4-BR
  rect 1x0.8 smd: 1(1.15,-0.95) 2(1.15,0.95) 3(-1.15,0)
SOT-89-3_L4.5-W2.5-P1.50-LS4.2-BR
  rect 1.575x0.672 smd: 1(1.356,-1.5) 3(1.356,1.5)
  custom 5.377x1.9 smd: 2(-1.356,0)
SOT-723-3_L1.2-W0.8-P0.80-LS1.2-BR
  rect 0.489x0.294 smd: 1(0.529,-0.4) 2(0.529,0.4)
  rect 0.489x0.434 smd: 3(-0.529,0)
SOT-1061_L2.0-W2.0-P1.30-BR
  rect 0.8x0.399 smd: 1(0.757,-0.65) 2(0.757,0.65)
  custom 1.625x1.6 smd: 3(-0.757,0)
SW-SMD_4P-L5.2-W5.2-P3.70-LS6.4
  rect 1.58x0.8 smd: 1(-3,1.85) 2(3,1.85) 3(-3,-1.85) 4(3,-1.85)
TO-220-3_L10.2-W4.6-P2.54-L
  rect 2x1.5 hole 1.4x0.8: 1(-2.54,0)
  oval 2x1.5 hole 1.4x0.8: 2(0,0) 3(2.54,0)
USB-C_SMD-TYPE-C-31-M-12
  oval 1.2x2 hole 0.6x1.5: 0(-4.325,1.706) 1(4.325,1.706)
  oval 1.2x1.8 hole 0.6x1.4: 2(4.325,-2.474) 3(-4.325,-2.474)
  rect 0.3x1.3 smd: A1(-3.35,2.474) A4(-2.55,2.474) A5(-1.25,2.474) A6(-0.25,2.474) A7(0.25,2.474) A8(1.25,2.474) A9(2.55,2.474) A12(3.35,2.474) B1(3.05,2.474) B4(2.25,2.474) B5(1.75,2.474) B6(0.75,2.474) B7(-0.75,2.474) B8(-1.75,2.474) B9(-2.25,2.474) B12(-3.05,2.474)
WDFN-5_L3.3-W3.3-P0.65-BL
  rect 0.42x0.66 smd: 1(-0.975,-0.735) 2(-0.325,-0.735) 3(0.325,-0.735) 4(0.975,-0.735)
  custom 3.48x2.265 smd: 5(0,0.735)
电容0402
  rect 0.55x0.54 smd: 1(-0.5,0) 2(0.5,0)
电容0603
  rect 0.7x0.9 smd: 1(-0.8,0) 2(0.8,0)

## Nets
36V_EN: D8.2 Q19.1 Q20.1 R70.2 U32.4
+3.3V: C11.2 C12.2 C13.2 C18.1 C19.1 C20.1 C21.1 C22.1 C29.1 C30.1 C32.1 C79.1 C87.1 C106.2 Q20.2 R20.1 R21.1 R22.1 R43.1 R49.1 R61.1 R65.2 R66.2 R98.2 U8.1 U8.19 U8.32 U8.48 U8.64 U11.4 U11.5 U11.11 U12.8 U13.8 U31.5 U39.5 U49.3
+4.8V: BUZZER1.1 C2.1 C5.2 C6.2 C7.2 C9.2 C17.1 C98.2 C105.2 L1.2 L4.1 Q18.2 R6.2 R72.1 U1.1 U1.3 U33.4 U33.5 U34.1 U35.1 U41.1 U49.2
+9V: C81.2 C82.2 C83.2 D12.2 R63.2 R84.2 U17.24
+36V: C93.2 D25.1 Q10.3 R46.2 R62.1
AGND: C2.2 C3.2 C14.1 C15.1 C26.2 C31.2 C68.2 C69.2 C70.2 C73.2 C74.2 C80.2 C84.2 C88.1 R19.2 R44.1 R60.2 R90.2 R95.2 R99.1 U1.2 U5.3 U8.12 U12.2 U13.2 U14.4 U23.2 U27.2 U30.1 U30.3 U47.4 U48.4
DGND: C4.2 C5.1 C6.1 C7.1 C8.1 C11.1 C12.1 C13.1 C16.1 C17.2 C18.2 C19.2 C20.2 C21.2 C22.2 C23.2 C24.1 C25.1 C27.1 C28.1 C29.2 C30.2 C32.2 C34.1 C35.1 C36.1 C37.1 C38.1 C39.1 C41.2 C44.1 C49.1 C50.1 C51.1 C52.1 C53.1 C54.1 C55.1 C56.1 C58.1 C64.1 C65.1 C66.1 C67.1 C76.1 C78.1 C79.2 C82.1 C83.1 C85.1 C86.1 C87.2 C91.1 C92.1 C93.1 C98.1 C99.1 C100.1 C101.1 C102.1 C103.1 C105.1 C106.1 D7.2 D11.2 D15.2 D23.2 LED1.2 Q5.2 Q7.2 Q10.2 Q13.2 Q14.2 Q15.2 Q16.2 Q17.2 Q19.2 Q21.2 R1.1 R5.1 R7.1 R9.1 R15.1 R16.1 R18.2 R19.1 R25.2 R27.1 R31.1 R32.1 R34.1 R39.1 R40.2 R56.2 R57.2 R76.1 R77.1 R78.2 R81.1 R89.1 R92.1 R93.1 R100.1 SW1.3 SW1.4 SW2.3 SW2.4 SW3.3 SW3.4 SW4.3 SW4.4 U2.7 U2.9 U3.2 U3.3 U7.11 U8.18 U8.31 U8.47 U8.60 U8.63 U11.2 U11.10 U11.13 U11.15 U11.16 U12.7 U13.7 U17.10 U17.22 U17.29 U25.3 U26.3 U30.4 U30.7 U31.2 U32.2 U33.2 U39.2 U43.1 U45.1 U49.1 USBC1.0 USBC1.1 USBC1.2 USBC1.3 USBC1.A1 USBC1.A12 USBC1.B1 USBC1.B12 USBC2.0 USBC2.1 USBC2.2 USBC2.3 USBC2.A1 USBC2.A12 USBC2.B1 USBC2.B12
VIN: C4.1 C52.2 C53.2 C54.2 C55.2 C56.2 C103.2 D2.2 D9.1 Q1.5 Q1.6 Q1.7 Q1.8 Q1.9 Q3.1 Q3.2 Q3.3 R2.2 R8.2 R85.2 U2.2 U17.3 U19.5
A0: U8.53 U11.8
A+2.5V: C15.2 C31.1 C73.1 R13.2 U5.1 U5.2 U12.3 U13.3
A+3.3V: C3.1 C14.2 C26.1 C68.1 C69.1 C70.1 C74.1 C80.1 C84.1 R13.1 R42.1 R47.2 R55.2 R97.2 U1.5 U8.13 U14.8 U23.5 U27.5 U30.8 U47.8 U48.8
ADC_PNTC: C88.2 R97.1 R99.2 U8.27
BOOT1: C42.2 D3.1 U17.26
BOOT2: C43.2 D4.1 U17.20
BUZZER: Q16.1 U8.22
CC1: U7.7 USBC1.A5
CC2: U7.6 USBC1.B5
DAC_CLK: U8.34 U12.5 U13.5
DAC_SDI: U8.36 U12.6 U13.6
DC_ADC: C86.2 R86.1 R93.2 U8.14
DC_EN: R25.1 U8.61 U17.1
DC_OUT: C34.2 C35.2 C36.2 C37.2 C38.2 C39.2 C40.2 R23.2 R29.2 R86.2 U16.2 U17.12 U18.2 U24.2
DC_VCC: C58.2 D3.2 D4.2 U17.23
DCCS: C59.2 R38.1 U17.16
DCCSG: C59.1 R40.1 U17.15
DCFB: C40.1 R29.1 R33.1 R34.2 U17.11
DM: U7.5 USBC1.A7 USBC1.B7
DP: U7.4 USBC1.A6 USBC1.B6
FANG_D: Q7.1 U8.2
FANJIEBH: D24.2 R75.1 U8.33 U31.4
FENGSHAN: Q13.1 U8.24
H-GUAN: D24.1 Q10.1 Q20.3 Q21.1 R78.1
HDRV1: R30.1 U17.27
HDRV2: R28.2 U17.19
HL-GUAN: R70.1 U8.8
I-IN: Q8.1 Q8.2 Q8.3 R77.2 R87.1
I_DAC: U12.1 U14.5
IDAC: U8.20 U47.3
IDAC_CS: U8.3 U12.4
IDAC_O: R54.2 U14.6 U14.7
IN_ADC: C85.2 R85.1 R92.2 U8.15 U39.1
IN_L: D8.1 U8.4 U39.4
ISNS+: C33.1 R24.1 U17.14
ISNS-: C33.2 R23.1 U17.13
KEY-+: C28.2 R61.2 SW4.1 U8.11
KEY--: C27.2 R49.2 SW3.2 U8.10
KEY-OK: C25.2 R43.2 SW2.2 U8.9
KEY-ON: C24.2 R22.2 SW1.2 U8.5
LDRV1: R36.1 U17.25
LDRV2: R37.2 U17.21
LED-B: U8.38 U44.1
LED-R: U8.37 U42.1
LEDK: Q17.1 U8.59
MOS_EN: C60.2 C62.1 Q6.2 R47.1 U25.2 U26.2
O+: H2.1 R88.2 R94.1
O-: H4.1 R79.1 R96.2
OUT+: C64.2 C65.2 C66.2 C67.2 D13.1 H1.1 Q4.5 R52.2 R88.1
OUT-: H3.1 Q8.5 R64.2 R96.1
OUT_I: C63.1 R59.1 R82.2 R101.1 U8.17 U30.6 U48.7
OUT_V: C61.2 R48.2 R80.2 U8.16 U27.1 U30.5
OUTMOS-G: Q5.3 R104.1
RST: C23.1 R21.2 U8.7
RX1: U8.43 U40.1
SCL: NOREF.TP1 R66.1 U7.2 U8.29 U30.10
SDA: NOREF#3.TP2 R65.1 U7.3 U8.30 U30.9
SPI_CS: U8.58 U11.3
SPI_RST: U8.52 U11.9
SPI_SCK: U8.55 U11.6
SPI_SDA: U8.57 U11.7
SW1: C42.1 D20.3 L2.1 U17.28 U19.1 U19.2 U19.3 U21.5
SW2: C43.1 D21.1 D21.2 L2.2 U17.18 U20.1 U20.2 U20.3 U22.5
SWCLK: R67.1 U8.49 U9.1
SWDIO: R69.2 U8.46 U10.1
TX1: U8.42 U37.1
UDBDM: R102.2 U8.44
USB-DM: R102.1 USBC2.A7 USBC2.B7
USB-DP: R103.1 USBC2.A6 USBC2.B6
USB-VIN: C16.2 Q2.5 Q2.6 Q2.7 Q2.8 Q2.9 R1.2 R4.2 U7.1 U7.8 USBC1.A4 USBC1.A9 USBC1.B4 USBC1.B9
USBDP: R103.2 U8.45
V_DAC: U13.1 U14.3
VDAC: U8.21 U47.5
VDAC_CS: U8.6 U13.4
VDAC_O: R53.2 U14.1 U14.2
$2N55557: BUZZER1.2 Q16.3
$2N79056: Q17.3 R105.1
$2N79059: R105.2 U11.12
$2N122357: C9.1 R6.1 R9.2 U2.5
$2N125522: C1.2 L1.1 U2.8
$2N128671: C1.1 U2.1
$2N128919: R2.1 U2.3
$2N129016: C8.2 U2.6
$2N129121: R7.2 U2.4
$2N136547: LED1.1 R20.2
$2N196551: R18.1 U7.9
$2N240212: R69.1 USBC2.A5
$2N240261: R67.2 USBC2.B5
$2N255770: Q3.5 Q3.6 Q3.7 Q3.8 Q3.9 R5.2 R12.2 U3.1
$2N258786: D9.2 Q3.4 R8.1 R11.2
$2N259137: Q15.3 R11.1 U4.1
$2N259374: D1.1 Q1.1 Q1.2 Q1.3 Q2.1 Q2.2 Q2.3 R3.2
$2N259912: D15.1 Q15.1 R12.1 R16.2
$2N267241: Q14.3 R10.2
$2N267271: D1.2 Q1.4 Q2.4 R3.1 R10.1
$2N267417: D23.1 Q14.1 R4.1 R15.2 U4.2
$5N3227: D2.1 R26.2
$5N3292: C41.1 R26.1 U17.2
$5N3392: R27.2 U17.4
$5N3532: R31.2 U17.5
$5N3623: R32.2 U17.6
$5N3702: C44.2 U17.7
$5N3781: C50.2 U17.8
$5N3965: C51.2 R35.1
$5N3978: C49.2 R35.2 U17.9
$5N21511: Q13.3 U36.1 U38.1
$5N52548: R33.2 U47.6 U47.7
$5N56481: C99.2 C100.2 C101.2 C102.2 D21.3 R24.2 U16.1 U18.1 U20.5
$5N56960: R94.2 R95.1 U27.3
$5N57108: R79.2 R80.1 U27.4
$5N57386: R81.2 R82.1 U48.6
$5N57415: R87.2 R90.1 U48.5
$5N58246: D20.1 D20.2 R38.2 R39.2 U21.1 U21.2 U21.3 U22.1 U22.2 U22.3
$5N58351: R28.1 U20.4
$5N58397: R37.1 U22.4
$5N58439: R30.2 U19.4
$5N58481: R36.2 U21.4
$5N64804: D6.1 Q4.4 R50.2 R104.2 U24.1
$5N80128: C81.1 R84.1 R89.2 U33.3
$5N80167: D12.1 L4.2 U33.1
$5N107551: D6.2 Q4.1 Q4.2 Q4.3 U24.3
$5N126012: Q7.3 R52.1
$5N232838: D25.2 Q6.3 R46.1 R50.1
$5N268269: C71.1 D7.1 R64.1 R68.1 U31.1
$5N268317: C71.2 D11.1 R71.1 R75.2 U31.3
$5N285026: D13.2 R68.2 R71.2
$5N317639: Q6.1 R55.1
$5N398369: C63.2 R45.2 R54.1 R57.1 R101.2 U26.1
$5N398626: C61.1 R41.1 R48.1 R53.1 R56.1 U25.1
$5N403868: R98.1 R100.2 U39.3
$5N403908: Q8.4 Q21.3 R63.1
$5N469769: L3.2 U29.2 U32.1
$5N470369: C72.1 R73.1 R76.2 U32.3
$5N471110: C62.2 R45.1
$5N471145: C60.1 R41.2
$5N476563: C72.2 C78.2 C92.2 R62.2 R73.2 U29.1
$5N477777: Q5.1 U23.1
$5N477783: R51.2 R58.1 U48.2
$5N477786: R59.2 R60.1 U48.3
$5N477787: R51.1 U23.3 U48.1
$5N477813: R58.2 U47.1 U47.2
$5N478090: R42.2 R44.2 U23.4
$5N505512: Q18.1 Q19.3 R72.2
$5N517048: C76.2 C91.2 L3.1 Q18.3 U32.5

Pads without a net: BUZZER1 3 4; NOREF#2 TP1; SW1 1; SW2 1; SW3 1; SW4 2; U1 4; U7 10; U8 23 25 26 28 35 39 40 41 50 51 54 56 62; U11 1 14; U17 17; U30 2; U33 6; USBC1 A8 B8; USBC2 A4 A8 A9 B4 B8 B9

## Via types
v1: diameter 0.5, hole 0.3, Top Layer to Bottom Layer, 340 vias
v2: diameter 0.5, hole 0.305, Top Layer to Bottom Layer, 64 vias
v3: diameter 0.61, hole 0.305, Top Layer to Bottom Layer, 41 vias

## Routing (per net, layer and track width the routed paths; a pad name or vN(x,y) marks a point on that pad's centre or on a via; arc(x,y) is an arc through that point)
36V_EN: length 33
  Top Layer w0.152: v1(31.38,7.98) 31.38,8.61 32.11,9.34 32.11,10.92 32.51,11.32 Q20.1 33.21,11.32 33.75,11.87 R70.2 33.9,12.2 D8.2
  Inner2 w0.152: v1(16.27,2.3) 16.54,2.03 30.37,2.03 32.05,3.71 32.05,7.33 31.4,7.98 v1(31.38,7.98)
  Bottom Layer w0.152: U32.4 18.65,2.76 16.82,2.76 16.36,2.3 v1(16.27,2.3)
  Bottom Layer w0.201: Q19.1 19.32,2.41 U32.4
+3.3V: length 154.6
  Top Layer w0.152: Q20.2 32.7,12.29 v1(32.7,12.95) ; 30.62,14.65 31.51,14.65 ; 39.46,41.39 39.4,41.34 39.4,40.56 39.57,40.4 ; v1(11.62,49.11) 11.36,49.11 R20.1 ; R66.2 39.4,40.22 39.4,39.21 C19.1 ; U12.8 36.36,23.82 35.43,24.75 34,24.75 33.28,25.47 R21.1
  Top Layer w0.201: U8.48 29.26,40.76 C20.1 ; 31.51,14.65 31.68,14.65 C79.1 32.05,14.51 32.7,13.86 v1(32.7,12.95) ; R49.1 42.28,34.51 v1(41.81,34.51)
  Top Layer w0.25: 41.78,31.5 41.73,31.44 40.67,31.44 ; U8.19 40.67,31.41 40.67,31.44 ; C22.1 40.7,31.47 40.67,31.44
  Top Layer w0.299: C21.1 27.52,28.97 27.14,29.35 26.36,29.35 C13.2 ; C13.2 25.63,30.41 U8.64 ; C13.2 25.05,30.25 ; 41.78,23.82 U12.8 39.77,25.12 C30.1 ; C29.1 7.83,37.16 7.05,37.16 6.75,36.86 U11.11 4.31,36.86 3.7,36.25 3.7,34.08 4.42,33.36 U11.4 ; v1(29.25,37.93) 29.25,39.9 U8.48 ; 41.78,18.17 41.71,18.1 C32.1 40.84,18.3 39.31,18.3 U13.8 ; U11.5 4.31,33.86 4.15,33.7
  Top Layer w0.3: C21.1 29.26,28.24 U8.1 ; 25.05,30.24 24.67,30.62 24.67,31.22 v1(24.42,31.47) ; U8.32 39.38,37.91 39.49,38.02 C19.1
  Top Layer w0.508: 29.39,30.33 29.39,31.35 v1(29.11,31.63) 29.11,37.79 v1(29.25,37.93) ; 29.29,30.19 27.96,28.86 27.63,28.86 ; 34.12,37.64 34.13,37.63 v1(34.82,37.63) ; 29.19,37.62 29.2,37.63 v1(33.43,37.63) v1(34.12,37.63)
  Top Layer w0.6: v1(41.81,34.51) v1(41.81,35.22) v1(41.81,35.84) 41.78,35.81 v1(41.78,17.47)
  Inner2 w0.152: v1(11.62,49.11) 9.82,49.11 7.73,47.01 7.73,44.77 5.01,42.06 5.01,39.91 7.59,37.33 v1(7.81,37.33)
  Inner2 w0.299: v1(38.3,18.11) 37.23,18.11 32.7,13.57 v1(32.7,12.95)
  Inner2 w0.508: v1(7.81,37.33) 8.74,36.39 27.72,36.39 v1(29.25,37.93)
  Bottom Layer w0.152: R22.1 44.34,16.39 44.29,16.44 C18.1 ; v1(29.11,31.63) 29.09,31.61 R98.2
  Bottom Layer w0.3: C87.1 23.22,32.44 U39.5 ; 24.25,32.44 24.42,32.27 v1(24.42,31.47)
  Bottom Layer w0.4: U49.3 43.27,16.44 C18.1
  Bottom Layer w0.508: v1(33.43,37.63) v1(34.12,37.63) v1(34.82,37.63) 39.94,37.63 41.73,35.84 v1(41.81,35.84) v1(41.81,35.22) v1(41.81,34.51) ; v1(38.3,18.11) 38.43,18.24 v1(41.77,18.24) ; v1(39.45,38.13) 39.45,37.66 ; 41.78,18.22 v1(41.78,17.47) 41.78,16.48 U49.3
+4.8V: length 101.1
  Top Layer w0.201: v1(44.72,31.89) 44.72,29.99 45.52,29.19 45.52,28.58 44.9,27.96 44.9,26.29 45.91,25.28 45.91,17.82 46.2,17.53 v1(46.2,17.51) ; C9.2 8.78,0.71 8.82,0.75
  Top Layer w0.3: R6.2 8.09,1.7 8.09,0.8 C9.2
  Top Layer w0.8: L1.2 17.85,1.71 16.85,0.7 9.09,0.7
  Top Layer w1.001: 18.58,5.06 22.25,5.06 ; 22.25,5.06 C5.2 ; 22.25,5.06 24.32,5.06 29.34,10.08 v1(29.34,10.49) ; v1(30.01,10.49) v1(29.34,10.49) ; v1(29.34,10.49) v1(28.56,10.49) ; L1.2 18.58,5.11
  Bottom Layer w0.201: U35.1 46.79,17.03 46.3,17.51 v1(46.2,17.51) ; R72.1 17.53,1.08 17.51,1.1 v1(17.34,1.1) ; BUZZER1.1 41.95,39.84 43.42,38.38 43.42,33.2 v1(44.72,31.89)
  Bottom Layer w0.45: C2.1 38.83,9.25 U1.1 40.04,9.38 40.71,9.38 41.14,9.81 41.14,10.76 40.76,11.15 U1.3 39.91,12.02 39.92,12.03 39.92,12.18 40.25,12.51 40.25,13.73
  Bottom Layer w0.508: U33.4 U33.5
  Bottom Layer w0.6: v1(13.9,0.64) 14.62,0.64 v1(14.65,0.61)
  Bottom Layer w0.8: v1(9.82,0.7) v1(9.13,0.7) 8.86,0.7 8.13,1.43 L4.1 4.07,2.29 C105.2 3.61,2.35 2.6,3.37 U33.4 ; 39.91,12.2 40.06,12.05 46.78,12.05 46.78,15.63 U35.1 ; 39.91,12.02 32.11,12.02 30.58,10.49 v1(30.01,10.49) v1(29.34,10.49) v1(28.56,10.49)
+9V: length 63.6
  Top Layer w0.152: U17.24 11.08,23.46 12.19,23.46 12.51,23.78 12.51,24.4 13.15,25.03 16.41,25.03 16.72,24.72 16.72,17.91 15.6,16.79 v1(15.43,16.79)
  Inner2 w0.299: v1(13.38,1.67) 13.39,1.66 30.53,1.66 33.19,4.31 33.19,4.72 v1(33.18,4.73)
  Inner2 w0.3: v1(13.56,5.14) 13.13,5.14 10.44,7.83 10.44,13.38 11.03,13.97 13.56,13.97 15.43,15.85 v1(15.43,16.79)
  Bottom Layer w0.152: C81.2 12.24,1.98 R84.2
  Bottom Layer w0.299: D12.2 10.83,6.28 C82.2 12.34,5.75 C83.2 13.12,5.54 13.46,5.2 13.46,1.62 13,1.16 C81.2 ; R63.2 33.04,4.73 v1(33.18,4.73)
+36V: length 40.5
  Top Layer w0.201: v1(24.98,9.16) 25.01,9.19 25.01,11.55 24.24,12.33 23.09,12.33 22.66,12.76 22.66,17.19 v1(21.58,18.27) ; v1(17.2,25.61) 17.2,28.02 17.72,28.54 D25.1 19.31,28.54 R46.2
  Bottom Layer w0.201: v1(17.2,25.61) 17.11,25.52 17.11,20.05 18.65,18.51 21.34,18.51 v1(21.58,18.27) ; Q10.3 30.27,2.04 C93.2 ; v1(24.98,9.16) 25.05,9.16 25.95,8.26 26.96,8.26 27.81,7.41 27.81,6.23 27.41,5.83 27.41,4.84 28.33,3.93 28.33,2.12
  Bottom Layer w0.299: C93.2 29.11,2.08 28.34,2.08 28.34,1.63 R62.1
AGND: length 163.3
  Top Layer w0.201: C26.2 35.17,25.35 34.71,25.35 34.39,25.67 34.39,26.9 34.76,27.27 U8.12
  Top Layer w0.299: U14.4 31.25,18.93 v1(31.81,18.93) 31.81,18.22 32.1,17.93 C31.2 32.12,17 33.74,17 ; U48.4 33.41,6.45 34.09,5.78 ; C74.2 30.47,25.01 v1(30.88,24.6) ; 32.28,22.47 34.15,22.47 v1(34.2,22.52) ; 34.09,5.78 34.1,5.76 R90.2 ; 34.09,5.78 34.08,5.77 ; 34.09,5.78 34.61,6.3 v1(35.02,6.3)
  Top Layer w0.3: C84.2 40.74,8.56 v1(41.1,8.2) ; v1(31.99,22.47) 32.05,22.53 32.45,22.53 ; 32.35,22.39 32.28,22.47
  Top Layer w0.4: R60.2 36.27,10.6 v1(36.28,10.59)
  Top Layer w0.5: v1(34.86,33.23) 34.86,35.31 v1(33.77,36.4) 33.75,36.38 v1(30.61,36.38)
  Top Layer w0.508: v1(36.18,24.82) 35.59,25.42 C26.2
  Inner2 w0.508: 32.78,23.31 32.85,23.38 ; 36.18,23.42 36.26,23.34 ; v1(34.86,33.23) 34.88,33.25 44.56,33.25 v1(44.67,33.14) ; 31.99,22.9 32.4,23.31 ; 31.99,22.9 v1(31.99,22.47) 31.99,19.11 v1(31.81,18.93) ; 31.99,22.9 31.99,23.51 ; 33.34,23.38 33.4,23.31
  Inner2 w1: v1(35.02,6.3) 35.09,6.37 35.09,8.23 ; 35.09,8.23 v1(35.09,8.72) 35.09,9.4 36.18,10.49 ; 35.09,8.23 39.6,8.23 ; v1(41.1,8.2) 41.09,8.2 39.77,8.2
  Inner2 w1.001: 34.16,23.31 34.2,23.31 ; 34.16,23.31 32.29,23.31 ; 34.16,23.31 36.26,23.34 v1(45.05,23.34) ; 31.99,23.51 30.9,24.6 v1(30.88,24.6) ; v1(41.1,8.2) 43.66,8.2 v1(43.68,8.23)
  Bottom Layer w0.201: U30.1 37.76,5.17 37.56,5.37 37.56,5.97 37.76,6.17 U30.3
  Bottom Layer w0.25: 47.65,8.53 47.65,6.57 45.52,4.44 41.54,4.44 40.81,5.17 U30.1 ; 47.49,8.69 47.53,8.65
  Bottom Layer w0.299: v1(34.86,33.23) 35.05,33.42 U47.4 ; C80.2 44.42,7.7 44.42,8.28 ; v1(35.09,8.72) 35.09,8.71 35.39,8.41 U27.2 ; v1(35.02,6.3) 35.02,6.26 R95.2
  Bottom Layer w0.3: R99.1 28.95,36.08 C88.1 30.31,36.08 30.61,36.38 v1(30.61,36.38) ; v1(36.28,10.59) 36.25,10.62 35.1,10.62 C70.2 ; v1(33.77,36.4) 33.13,36.4 C68.2 ; 32.06,22.54 R44.1
  Bottom Layer w0.45: U1.2 39.11,10.2 38.94,10.37 C2.2
  Bottom Layer w0.508: v1(34.2,22.52) 34.45,22.77 35.81,22.77 36.26,23.22 36.26,24.74 v1(36.18,24.82) ; v1(34.2,22.52) 33.99,22.72 32.24,22.72 32.06,22.54 ; v1(34.2,22.52) 34.2,22.15 34.21,22.15 U23.2 ; v1(35.09,8.72) 34.9,8.91 34.9,10.57 C70.2 ; v1(41.1,8.2) 38.43,8.2 37.84,8.8 37.84,10.21 38,10.37 C2.2 ; v1(44.67,33.14) 44.67,33.52 45.96,34.82 49.2,34.82
  Bottom Layer w1: 47.53,8.65 44.79,8.65 44.34,8.2 v1(41.1,8.2) ; 49.2,23.33 49.2,10.26 47.65,8.71
  Bottom Layer w1.001: 43.8,23.33 49.2,23.33 49.2,34.82 49.2,44.35 47.49,46.06 R19.2
  vias: v1(42.82,8.22) v1(43.79,23.34) v1(44.41,23.33)
DGND: length 392.1
  Top Layer w0.152: R5.1 19.5,42.83 v1(19.36,42.69) ; v1(25.89,12.59) 25.68,12.38 D11.2 ; R7.1 3.07,0.79 v1(3.05,0.81) ; R40.2 9.54,16.14 8.59,17.09 8.59,17.93 v1(8.58,17.94) ; U17.29 8.2,20.53
  Top Layer w0.201: 39.53,2.99 R81.1 39.56,5.94 v1(40.46,5.94) ; Q15.2 24.8,39.05 R16.1 ; C29.2 9.04,37.41 9.04,37.96 v1(9.27,38.19) ; U13.7 41.02,17 C32.2 ; v1(24,33.81) 24.83,33.81 26.22,32.41 U8.60 ; SW4.4 46.85,43.41 ; D7.2 v1(31.05,17.6) ; C13.1 25.88,30.91 U8.63 ; R56.2 25.73,15.98 v1(25.75,15.97) ; v1(40.45,30.5) 40.03,30.91 U8.18 ; U8.47 29.76,41.15 v1(29.46,41.45) ; 39.53,2.41 R77.1 ; 8.52,22.17 8.39,22.31 R25.2 8.39,28.24 8.12,28.5 6.44,28.5 6.04,28.11 6.04,28.01 ; U11.15 3.38,39.83 3.38,38.87 4.39,37.86 U11.13 ; v1(25.46,21.31) 25.45,21.32 25.45,21.33 25.44,21.32 R57.2
  Top Layer w0.25: v1(44.89,24.53) 44.47,24.96 C25.1
  Top Layer w0.299: U31.2 28.43,13.7 31.54,13.7 31.74,13.51 ; v1(12.82,35.17) 13.92,35.17 C52.1 12.63,36.09 v1(11.81,35.27) ; C21.2 28.01,27.15 v1(28.25,27.38) ; R31.1 1.92,23.49 1.5,23.07 R27.1 0.74,22.81 0.74,20.48 1.02,20.2 C49.1 ; v1(4.44,36.06) 4.74,36.36 U11.10 ; 45.18,35.12 45.18,34.57 ; 45.18,35.12 v1(45.17,35.13) ; 45.18,35.12 C28.1 45.18,35.79 v1(45.15,35.83) ; v1(40.8,22.13) 40.39,22.55 U12.7 ; C49.1 1.4,20.42 1.4,21.2 2.52,21.2 C50.1 C44.1 ; C49.1 1.07,20.09 R34.1 ; 48.73,35.43 48.7,35.46 48.6,35.56 ; R7.1 4.78,0.79 v1(4.97,0.6) ; C19.2 40.58,37.71 40.34,37.47 40.31,37.47 40.25,37.41 U8.31 37.12,37.41 37.09,37.45 37.09,38.12 37.89,38.92 37.89,40.98 35.22,43.65 32.53,43.65 USBC2.0 ; C7.1 23.92,2.85 23.69,2.62 22.8,2.62 v1(22.71,2.53) ; v1(0.6,2.89) 0.68,2.97 C4.2 ; C27.1 45.18,34.97 ; v1(30.41,17.62) 30.41,17.37 D7.2 ; U11.2 2.98,32.36 2.81,32.19 ; LED1.2 7.69,49.25 5.26,49.25 USBC1.3 ; v1(40.21,26.23) C11.1 39.13,26.84 38.54,26.25 38.54,25.27 C30.2 ; v1(5,1.25) 5.37,1.62 R9.1 ; 5.71,20.23 7.89,20.23 8.2,20.53 ; v1(28.67,30.78) 28.67,30.79 28.54,30.91 U8.63 ; U11.16 4.08,29.96 6.04,28.01 C41.2 ; C58.1 13.45,22.17 11.49,22.17 ; 48.63,34.57 48.66,34.59 ; 8.52,22.17 11.06,22.17 ; C8.1 12.36,1.74 v1(12.86,2.24)
  Top Layer w0.399: v1(19.65,29.78) 20.17,30.3 v1(20.37,30.3) ; C6.1 20.35,0.99 v1(20.8,0.55) 21.48,0.55 v1(21.5,0.56) ; v1(25.12,19.08) 25.11,19.07 U25.3
  Top Layer w0.5: C20.2 25.9,41.59 U3.3
  Top Layer w0.508: v1(14.35,22.16) 13.74,22.16 C58.1 ; C106.1 C12.1 C11.1 ; v1(31.7,13.19) 31.7,13.47 31.74,13.51 C79.2 ; SW3.3 SW3.4 ; C6.1 22.34,2.98
  Top Layer w0.6: 9.05,5.66 6.78,5.66 U2.9 ; U25.3 22.1,19.54 U26.3 22.1,25.14 v1(21.75,25.49) ; 2.81,30.1 2.81,32.19
  Top Layer w0.8: C67.1 C66.1 C64.1 C65.1
  Top Layer w1.001: v1(20.2,6.94) 18.34,6.94 17.9,7.38 C67.1 ; 20.84,31.22 20.84,34.37 22.33,34.37 v1(22.91,33.79) 22.91,33.29 20.84,31.22 ; 20.84,31.22 20.81,31.19 20.82,31.19 20.84,31.19
  Top Layer w1.5: USBC2.2 USBC2.1
  Top Layer w1.501: U11.16 2.81,30.1 1.64,31.27 1.6,31.27 ; 1.37,31.74 1.37,38.68 2.94,40.26 U11.15 2.94,42.76 USBC1.0
  Top Layer w1.999: 40.59,46.14 47.76,46.14 48.7,45.2 48.7,5.9 46.54,3.73 40.85,3.75 39.61,2.51 R77.1
  Inner1 w0.152: v1(3.03,35.95) 3.11,35.95 4.17,34.89 4.17,19.89 5.3,18.75 7.9,18.75 8.58,18.07 v1(8.58,17.94)
  Inner2 w1.199: 15.52,42.3 15.56,42.3
  Bottom Layer w0.152: v1(25.89,12.59) 26.25,12.95 C37.1 ; R1.1 8.03,39.24 Q14.2 ; 33.78,31.81 v1(34.1,32.13) 34.1,32.11 C86.1 ; R39.1 3.69,38.77 D23.2 3.69,40.38 R15.1 ; v1(5,1.25) 4.7,0.95 C105.1 ; Q21.2 33.72,1.81 32.77,0.87 ; v1(27.22,38.79) 27.22,38.32 D15.2
  Bottom Layer w0.201: 30.99,17.6 Q7.2 ; 26.26,20.51 v1(25.46,21.31) ; 33.41,31.81 34.28,31.81 C86.1 ; v1(40.46,5.94) 40.45,5.95 40.45,6.65 ; U30.4 U30.7
  Bottom Layer w0.299: C85.1 27.21,34.6 R92.1 27.16,35.28 26.79,35.65 26.79,37.89 D15.2 ; USBC2.B12 USBC2.A1 ; v1(43.04,14.45) 43.27,14.69 C18.2 ; 26.09,26.76 26.71,27.38 v1(28.25,27.38) ; v1(3.05,0.81) 3.93,0.81 C105.1 ; v1(0.6,2.89) 0.64,2.89 C98.1 ; v1(38.48,0.59) 38.21,0.87 Q10.2 29.23,0.87 C93.1 ; v1(10.19,4.97) 10.81,4.35 C82.1 12.44,4.35 C83.1 12.54,3.61 R89.1 12.86,2.36 v1(12.86,2.24) ; v1(4.44,36.06) 3.2,37.3 3.03,37.3 ; 26.45,31.49 25.47,31.49 v1(25.36,31.61) ; R100.1 28.67,30.52 v1(28.67,30.78) ; v1(21.5,0.56) 21.54,0.6 R76.1 ; v1(31.15,15.63) 31.15,17.51 v1(31.05,17.6) 30.42,17.6 v1(30.41,17.62) 30.41,17.78 Q7.2
  Bottom Layer w0.3: C87.2 22.92,30.12 22.21,29.42 C53.1 ; C76.1 17.89,5.33 18.98,5.33 19.99,6.34 19.99,6.64 C99.1
  Bottom Layer w0.399: v1(25.12,19.08) 26.05,19.08 26.25,19.27 ; v1(24.78,3.53) 25.21,3.53 25.23,3.56 v1(25.51,3.56) ; C17.2 37.38,13.35 v1(38.12,13.35)
  Bottom Layer w0.5: 39.19,43.9 39.17,43.91 39.17,43.88 39.19,43.9 ; 39.19,43.9 40.09,43.9 40.27,43.72
  Bottom Layer w0.508: 33.41,31.81 33.41,32.17 v1(33.35,32.22) ; U32.2 22.39,3.36 22.81,3.78 24.53,3.78 v1(24.78,3.53) ; v1(31.7,13.19) 31.7,14.97 31.68,14.99 31.68,15.1 v1(31.15,15.63) ; Q16.2 43.84,44.62 v1(43.84,45.77) ; v1(47.8,30.86) 47.42,30.47 Q13.2 47.48,30.32 v1(47.48,29.44)
  Bottom Layer w0.6: C53.1 20.38,29.58 v1(20.38,30.95) 19.48,30.95 19.03,30.5 19.03,30.4 v1(19.65,29.78) ; C53.1 21.14,30.01 v1(21.14,30.94) ; C53.1 18.79,27.67 16.55,27.67 16.13,27.25 16.13,25.32 14.35,23.55 v1(14.35,22.16) ; USBC2.0 31.69,43.72 USBC2.A1 ; v1(38.12,13.35) 38.72,13.95 38.72,16.41 U49.1 37.14,16.44 36.76,16.06 v1(36.76,15.18) ; v1(21.6,7.04) 20.3,7.04 v1(20.2,6.94)
  Bottom Layer w0.8: v1(33.81,26.76) 33.52,26.47 v1(33.21,26.47)
  Bottom Layer w1: R39.1 1.1,37.3 1,37.2 v1(1,35.94) ; 20.42,7.88 20.48,7.82 v1(21.6,7.82) ; C102.1 C101.1 C100.1 C99.1 ; 3.03,37.3 v1(3.03,35.95)
  Bottom Layer w1.001: C34.1 27.62,21.83 v1(27.95,21.83) ; C36.1 26.54,20.3 v1(28.35,20.3)
  Bottom Layer w1.199: 40.33,45.34 40.33,44.67 40.34,44.66 USBC2.1 ; C38.1 26.27,25.49 C34.1 26.25,23.16 26.25,20.02 ; 26.09,25.68 C39.1 ; C37.1 26.25,19.27
  vias: v1(0.65,2.23) v1(0.7,8.85) v1(0.67,8.12) v1(1.01,41.56) v1(1.01,40.76) v1(1.01,39.96) v1(1.01,39.16) v1(1.01,38.36) v1(1.02,35.15) v1(1,34.14) v1(1.12,46.5) v1(1.12,45.7) v1(1.12,44.9) v1(1.12,44.1) v1(1.12,43.3) v1(1.28,2.8) v1(1.86,35.91) v1(1.91,35.08) v1(1.91,34.13) v1(2.64,21.99) v1(2.64,21.33) v1(2.72,23.52) v1(2.9,46.89) v1(2.9,46.09) v1(2.9,45.29) v1(2.9,44.49) v1(2.9,43.69) v1(4.51,3.54) v1(4.92,5.6) v1(5.24,3.58) v1(5.75,5.62) v1(5.91,3.56) v1(6.53,39.54) v1(7.14,39.29) v1(7.95,5.91) v1(12.98,22.23) v1(14.15,3.49) v1(14.37,2.31) v1(14.41,5.07) v1(14.4,4.39) v1(15.04,2.3) v1(16.31,13.91) v1(19.71,7.48) v1(19.7,6.45) v1(20.21,3.34) v1(20.35,2.59) v1(20.65,7.47) v1(20.66,6.45) v1(20.91,3.36) v1(21.53,19.52) v1(21.58,20.27) v1(21.68,26.16) v1(22.66,3.33) v1(23.03,34.87) v1(23.59,34.52) v1(24.14,8.64) v1(27.97,38.97) v1(31.08,17) v1(31.14,16.33) v1(31.25,13.69) v1(35.27,15.16) v1(37.36,14.45) v1(37.68,3.79) v1(37.68,2.99) v1(37.68,2.19) v1(37.68,1.39) v1(37.68,0.59) v1(38.48,3.79) v1(38.48,2.99) v1(38.48,2.19) v1(38.48,1.39) v1(39.28,3.79) v1(39.28,2.99) v1(39.28,2.19) v1(39.28,1.39) v1(39.28,0.59) v1(40.08,3.79) v1(40.08,2.99) v1(40.08,2.19) v1(40.08,1.39) v1(40.08,0.59) v1(40.43,38.32) v1(40.84,25.76) v1(40.87,24.86) v1(40.88,3.79) v1(40.88,2.99) v1(40.88,2.19) v1(40.88,1.39) v1(40.88,0.59) v1(42.01,15.04) v1(42.01,14.43) v1(42,13.8) v1(42.04,13.13) v1(42.69,45.84) v1(42.73,13.82) v1(42.74,13.18) v1(43.94,39.93) v1(44.17,47.03) v1(44.37,38.79) v1(44.34,1.77) v1(44.38,3.01) v1(44.75,37.12) v1(44.81,40.75) v1(45.14,1.77) v1(45.18,3.01) v1(45.94,1.77) v1(45.98,3.01) v1(46.74,1.77) v1(46.78,3.01) v1(47.54,1.77) v1(47.58,3.01) v3(7.46,23.34) v3(7.46,22.14) v3(7.46,20.94) v3(7.46,19.74) v3(8.98,23.34) v3(8.98,22.14) v3(8.98,20.94) v3(8.98,19.74) v3(22.38,42.59) v3(22.38,41.39) v3(22.38,40.19) v3(27.64,49.17) v3(27.64,48.27) v3(27.62,47.46) v3(27.62,46.56) v3(28.54,49.17) v3(28.54,48.27) v3(28.52,47.46) v3(28.52,46.56) v3(29.44,49.17) v3(29.44,48.27) v3(29.42,47.46) v3(33.52,48.94) v3(33.48,48.12) v3(34.72,48.94) v3(34.68,48.12) v3(35.92,48.94) v3(35.88,48.12) v3(37.12,48.94) v3(37.08,48.12) v3(38.32,48.94) v3(38.28,48.12) v3(45.31,49.07) v3(45.31,48.17) v3(46.21,49.07) v3(46.21,48.17) v3(47.11,49.07) v3(47.11,48.17) v3(47.88,38.25) v3(47.88,37.05) v3(47.88,35.85)
VIN: length 56.7
  Top Layer w0.201: 1.65,25.2 2.07,24.77 U17.3
  Top Layer w0.299: 1.68,4.86 1.68,5.62 ; 0.9,5.75 0.9,6.31
  Top Layer w0.6: U2.2 3.19,5.62 1.68,5.62 1.65,5.65 v1(1.39,5.65) ; C4.1 0.68,6.12 C103.2
  Inner2 w0.201: 1.97,25.65 1.97,25.58 v1(2.72,24.83)
  Inner2 w1.199: 0.9,5.92 1.83,6.86 1.83,9.6 1.12,10.32 1.12,24.8 1.97,25.65 4.34,28.02 4.34,28.03 11.78,28.03 15.33,31.59 15.4,31.59
  Bottom Layer w0.152: 20.24,33.58 21.06,34.4 C56.2 21.89,34.86 21.89,35.15 22.47,35.73 D9.1 23.49,35.95 R8.2
  Bottom Layer w0.201: R85.2 24.6,33.09 21.18,33.09 C53.2
  vias: v1(0.74,6.55) v1(0.69,5.87) v1(1.39,6.3) v1(1.51,7.04) v2(14.2,33.88) v2(14.2,32.68) v2(14.2,31.48) v2(14.2,30.28) v2(15.4,33.88) v2(15.4,32.68) v2(15.4,31.48) v2(15.4,30.28) v2(16.6,33.88) v2(16.6,32.68) v2(16.6,31.48) v2(16.6,30.28) v2(17.8,33.88) v2(17.8,32.68) v2(17.8,31.48) v2(17.8,30.28)
(no net): length 1.9
  Top Layer w0.201: U8.26 39.95,34.91 40.43,35.39
A0: length 23.9
  Top Layer w0.152: U11.8 6.27,35.36 7.15,36.24 10.34,36.24 12.54,38.44 16.83,38.44 18.32,36.95 25,36.95 26.04,35.91 U8.53
A+2.5V: length 26.6
  Top Layer w0.201: 32.71,21.38 32.65,21.44 C73.1
  Top Layer w0.299: C73.1 32.51,21.38 34.13,21.38 U12.3 ; v1(35.17,18.35) 35.17,16.07 34.82,15.73 32.25,15.73 C31.1
  Top Layer w0.3: 34.13,21.38 34.95,21.38 35.6,20.73 35.6,19.49 v1(35.54,19.43)
  Bottom Layer w0.4: 35.98,18.92 35.8,18.92 35.23,18.35 v1(35.17,18.35) ; 35.98,18.92 43.6,18.92 ; 35.98,18.92 35.54,19.36 v1(35.54,19.43)
  Bottom Layer w0.508: U5.1 U5.2 45.83,20.7 44.7,20.7 C15.2 44.37,19.45 43.84,18.92 ; 43.93,18.88 43.89,18.92 43.84,18.92 ; 43.69,18.92 43.6,18.92 43.6,18.83 43.69,18.92 ; 43.69,18.92 43.84,18.92
A+3.3V: length 102.9
  Top Layer w0.152: v1(27.44,26.12) 27.35,26.12 26.9,26.57 26.9,27.6 26.52,27.98 R47.2 26.12,28.53 25.63,29.02 24.48,29.02 23.89,29.6 R55.2
  Top Layer w0.2: U48.8 38.67,8.4 38.8,8.53 ; v1(29.52,22.13) 29.19,22.46 U14.8
  Top Layer w0.201: v1(45.38,7.63) 43.71,9.3 v1(43.05,9.3) ; U14.8 29.19,25 C74.1 ; U8.13 35.26,26.79 v1(35.06,26.59) 35.08,26.59
  Top Layer w0.3: C84.1 38.8,8.91 39.19,9.3 v1(43.05,9.3)
  Inner2 w0.201: v1(32.33,35.16) 32.33,35.16 32.74,34.74 32.74,31.48 31.56,30.3 31.56,25.57 31.57,25.57
  Inner2 w0.399: v1(33.9,11.13) 33.92,11.1 33.92,10.54 33.43,10.04 32.1,10.04 30.33,11.81 30.33,16.16 29.54,16.95 29.54,22.12 v1(29.52,22.13) 29.52,25.45 29.58,25.51 ; v1(35.06,26.59) 35.03,26.59 33.98,25.54 28.02,25.54 v1(27.44,26.12)
  Inner2 w0.4: v1(33.9,11.13) 33.99,11.13 34.76,11.9 37.44,11.9 40.03,9.3 v1(43.05,9.3)
  Bottom Layer w0.201: U27.5 33.73,10.48 33.9,10.65 ; 33.9,10.65 C70.1 ; 33.9,10.65 v1(33.9,11.13) ; U30.8 44.26,6.17 44.56,6.47 44.99,6.47 45.38,6.86 v1(45.38,7.63) ; R97.2 27.83,35.89 28.36,35.37 U47.8 32.12,35.37 v1(32.33,35.16)
  Bottom Layer w0.299: R42.1 33.05,24.92 33.32,25.19 C69.1 ; C14.2 47.24,18.88 R13.1 ; U23.5 35.15,24.06 34.66,24.55 C69.1 ; C69.1 35.09,25.62 35.09,26.57 v1(35.06,26.59)
  Bottom Layer w0.3: U47.8 30.97,35.68 31.83,36.54 C68.1
  Bottom Layer w0.4: 44.06,9.79 43.63,9.79 43.15,9.3 v1(43.05,9.3) 43,9.25 U1.5 ; C14.2 47.42,18.7 47.42,17.79 48.35,16.87 48.35,10.91 47.28,9.85 44.23,9.85 44.16,9.79 C3.1
  vias: v1(42.37,9.26)
ADC_PNTC: length 11.8
  Top Layer w0.201: v1(37.33,35.42) 37.41,35.42 37.42,35.41 U8.27
  Bottom Layer w0.201: R97.1 28.82,37.07 R99.2 29.71,37.07 C88.2 29.73,37.09 35.95,37.09 37.33,35.71 v1(37.33,35.42)
BOOT1: length 6.4
  Top Layer w0.152: C42.2 13.21,26.94 12.58,26.31 12.58,25.39 11.96,24.77 U17.26
  Top Layer w0.299: C42.2 15.16,26.94 D3.1
BOOT2: length 4.8
  Top Layer w0.152: D4.1 14.14,20.83 C43.2 13.16,20.87 U17.20
BUZZER: length 12.4
  Top Layer w0.152: 41.88,37.23 41.13,36.49 41.13,33.96 40.08,32.91 U8.22 ; 41.9,37.27 42.23,37.6 42.23,39.43 42.7,39.9 v1(42.82,39.9)
  Bottom Layer w0.152: Q16.1 44.32,41.86 42.82,40.36 v1(42.82,39.9)
CC1: length 4.8
  Top Layer w0.201: 10.02,47.27 10.02,46.5 v1(10.05,46.47)
  Bottom Layer w0.201: v1(10.05,46.47) 9.54,46.47 7.76,44.68 USBC1.A5
CC2: length 3.7
  Top Layer w0.152: v1(11.03,46.44) 11.03,47.26 U7.6
  Bottom Layer w0.201: USBC1.B5 10.76,46.14 11.03,46.42 v1(11.03,46.44)
DAC_CLK: length 30.1
  Top Layer w0.152: v1(36.37,30.44) 36.37,30.95 35.9,31.42 35.9,38.42 36.26,38.78 U8.34
  Top Layer w0.201: U12.5 38.32,20.01 38.32,20.01 ; U13.5 38.42,14.46 37.26,15.61 37.26,18.95 38.32,20.01 ; 38.32,20.01 38.04,20.28 v1(38.04,20.45)
  Bottom Layer w0.152: v1(36.37,30.44) 36.35,30.42 36.35,29.86 38.38,27.83 38.38,20.78 v1(38.04,20.45)
DAC_SDI: length 32.9
  Top Layer w0.152: U12.6 39.7,21.21 v1(37.79,21.21) ; v1(35.65,30.99) 35.6,31.05 35.6,38.48 35.26,38.81 U8.36
  Top Layer w0.201: U12.6 40.62,21.28 41.17,20.73 41.17,19.51 40.85,19.2 38.22,19.2 37.61,18.59 37.61,16.38 38.27,15.73 U13.6
  Bottom Layer w0.152: v1(35.65,30.99) 35.84,30.8 35.84,29.94 38.08,27.71 38.08,21.5 v1(37.79,21.21)
DC_ADC: length 5.6
  Top Layer w0.152: U8.14 35.76,29.7 34.59,30.87 ; 34.58,30.87 34.52,30.92 v1(33.87,30.92)
  Bottom Layer w0.152: 32.41,30.94 34.28,30.94 C86.2
DC_EN: length 28.9
  Top Layer w0.152: R25.1 7.52,27.13 6.47,26.07 U17.1 ; v1(14.58,28.58) 14.58,28.59 15.3,29.3 21.74,29.3 22.19,29.75 22.19,31.23 23.41,32.45 25.44,32.45 25.98,31.91 U8.61
  Top Layer w0.201: U17.1 5.33,26.53 v1(5.36,26.56)
  Inner2 w0.152: v1(5.36,26.56) 6.01,27.2 12.12,27.2 13.5,28.58 v1(14.58,28.58)
DC_OUT: length 43.2
  Top Layer w0.152: v1(16.46,16.25) 16.4,16.31 13.99,13.89 8.14,13.89 7.48,14.54 7.48,14.24 7.02,13.78 4.52,13.78 2.45,15.85 R29.2 2.3,16.24 2.95,16.89 C40.2 3.12,16.99 3.56,17.44 3.56,17.9 4.58,18.92 5.33,18.92 U17.12
  Inner2 w0.152: v1(31.95,31.72) 30.85,31.72 26.08,26.96 v1(24.45,26.96)
  Bottom Layer w0.152: R86.2 32.34,31.72 v1(31.95,31.72) ; U16.2 21,16.87 20.1,17.77 16.84,17.77 16.25,17.18 16.25,16.43 16.43,16.25 v1(16.46,16.25)
  Bottom Layer w1.001: C34.2 23.23,23.41 24.08,24.26 C38.2 ; C39.2 24.09,25.68
